# EAGLE schematic 4 output Igniter (EAGLE 6.2)
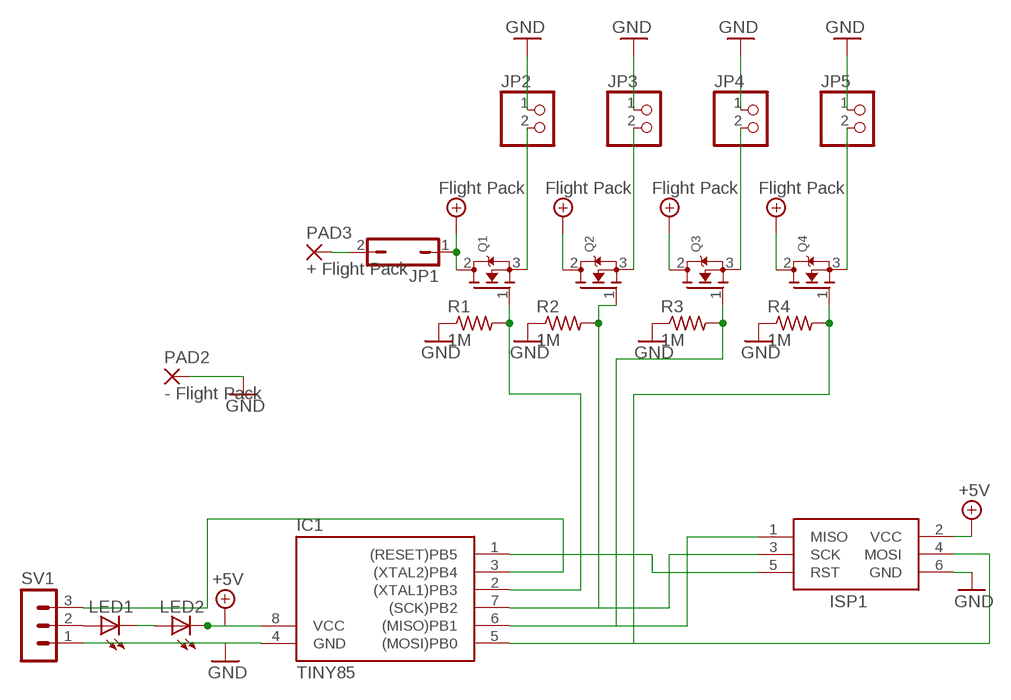
[diagram p0: schematic, sheet 1]

## Parts
IC1  TINY85  TINY12P  [DIL08]
ISP1  AVRISP-6  [AVRISP]
JP1  JP1Q  [JP1]
JP2  PINHD-1X2  [1X02]
JP3  PINHD-1X2  [1X02]
JP4  PINHD-1X2  [1X02]
JP5  PINHD-1X2  [1X02]
LED1  LED3MM  [LED3MM]
LED2  LED3MM  [LED3MM]
PAD2  - Flight Pack  2,15/1,0  [2,15/1,0]
PAD3  + Flight Pack  2,15/1,0  [2,15/1,0]
Q1  MOSFET-NGDS_TO220V  [TO220V]
Q2  MOSFET-NGDS_TO220V  [TO220V]
Q3  MOSFET-NGDS_TO220V  [TO220V]
Q4  MOSFET-NGDS_TO220V  [TO220V]
R1  1M  R-US_0204/2V  [0204V]
R2  1M  R-US_0204/2V  [0204V]
R3  1M  R-US_0204/2V  [0204V]
R4  1M  R-US_0204/2V  [0204V]
SV1  MA03-1  [MA03-1]

## Nets
+5V: IC1.8(VCC) ISP1.2(VCC) LED2.K(C)
FP: JP1.1 Q1.2(D) Q2.2(D) Q3.2(D) Q4.2(D) ; supply symbol labelled Flight Pack
GND: IC1.4(GND) ISP1.6(GND) JP2.1 JP3.1 JP4.1 JP5.1 PAD2.1(P) R1.1 R2.1 R3.1 R4.1 SV1.1
N$1: IC1.7((SCK)PB2) ISP1.3(SCK) Q2.1(G) R2.2
N$2: IC1.6((MISO)PB1) ISP1.1(MISO) Q3.1(G) R3.2
N$3: JP1.2 PAD3.1(P)
N$4: IC1.1((RESET)PB5) ISP1.5(RST)
N$5: IC1.3((XTAL2)PB4) SV1.3
N$6: LED1.A SV1.2
N$7: LED1.K(C) LED2.A
N$8: IC1.2((XTAL1)PB3) Q1.1(G) R1.2
N$9: JP2.2 Q1.3(S)
N$10: JP3.2 Q2.3(S)
N$11: JP4.2 Q3.3(S)
N$12: JP5.2 Q4.3(S)
N$16: IC1.5((MOSI)PB0) ISP1.4(MOSI) Q4.1(G) R4.2

## Library data of the parts
IC1 = atmel:TINY12*: MICROCONTROLLER 1 Kbytes FLASH 64 bytes EEPROM; OC_FARNELL: unknown; OC_NEWARK: unknown
ISP1 = adafruit:AVRISP: AVR ISP HEADER Standard 6 pin header for AVR programming
JP1 = jumper:JP1Q: JUMPER
JP2-JP5 = pinhead:PINHD-1X2: PIN HEADER
LED1 LED2 = adafruit:LED: LED OSRAM: - CHIPLED LG R971, LG N971, LY N971, LG Q971, LY Q971, LO R971, LY R971 LH N974, LH R974 LS Q976, LO Q976, LY Q976 LO Q996 - Hyper CHIPLED LW Q18S LB Q993, LB Q99A, LB R99A - SideLED LS A670, LO A670, LY A670, LG A670, LP A670 LB A673, LV A673, LT A673, LW A673 LH A674 LY A675 LS A676, LA A676, LO A676, LY A676, LW A676 LS A679, LY A679, LG A679 - Hyper Micro SIDELED® LS Y876, LA Y876, LO Y876, LY Y876 LT Y87S - SmartLED LW L88C, LW L88S LB L89C, LB L89S, LG L890 LS L89K, LO L89K, LY L89K LS L896, LA L896, LO L896, LY L896 - TOPLED LS T670, LO T670, LY T670, LG T670, LP T670 LSG T670, LSP T670, LSY T670, LOP T670, LYG T670 LG T671, LOG T671, LSG T671 LB T673, LV T673, LT T673, LW T673 LH T674 LS T676, LA T676, LO T676, LY T676, LB T676, LH T676, LSB T676, LW T676 LB T67C, LV T67C, LT T67C, LS T67K, LO T67K, LY T67K, LW E67C LS E67B, LA E67B, LO E67B, LY E67B, LB E67C, LV E67C, LT E67C LW T67C LS T679, LY T679, LG T679 LS T770, LO T770, LY T770, LG T770, LP T770 LB T773, LV T773, LT T773, LW T773 LH T774 LS E675, LA E675, LY E675, LS T675 LS T776, LA T776, LO T776, LY T776, LB T776 LHGB T686 LT T68C, LB T68C - Hyper Mini TOPLED® LB M676 - Mini TOPLED Santana® LG M470 LS M47K, LO M47K, LY M47K Source: http://www.osram.convergy.de/
PAD2 PAD3 = wirepad:2,15/1,0: THROUGH-HOLE PAD
Q1-Q4 = adafruit:MOSFET-N: N-Channel Mosfet 2N7002E - 60V 260mA SOT23 [Digikey: 2N7002ET1GOSTR-ND] - REEL BSH103 - 30V 850mA SOT23 [Digikey: 568-5013-1-ND]
R1-R4 = adafruit:R-US_: RESISTOR, American symbol
SV1 = con-lstb:MA03-1: PIN HEADER; OC_FARNELL: unknown; OC_NEWARK: unknown